# Altium schematic sheet FTDIProgrammer.SchDoc: FTDI Programming for MT3620
size A4; DrawnBy: Dheeraj R; DocumentNumber: 2; Revision: 2.0; SheetNumber: 2; SheetTotal: 5
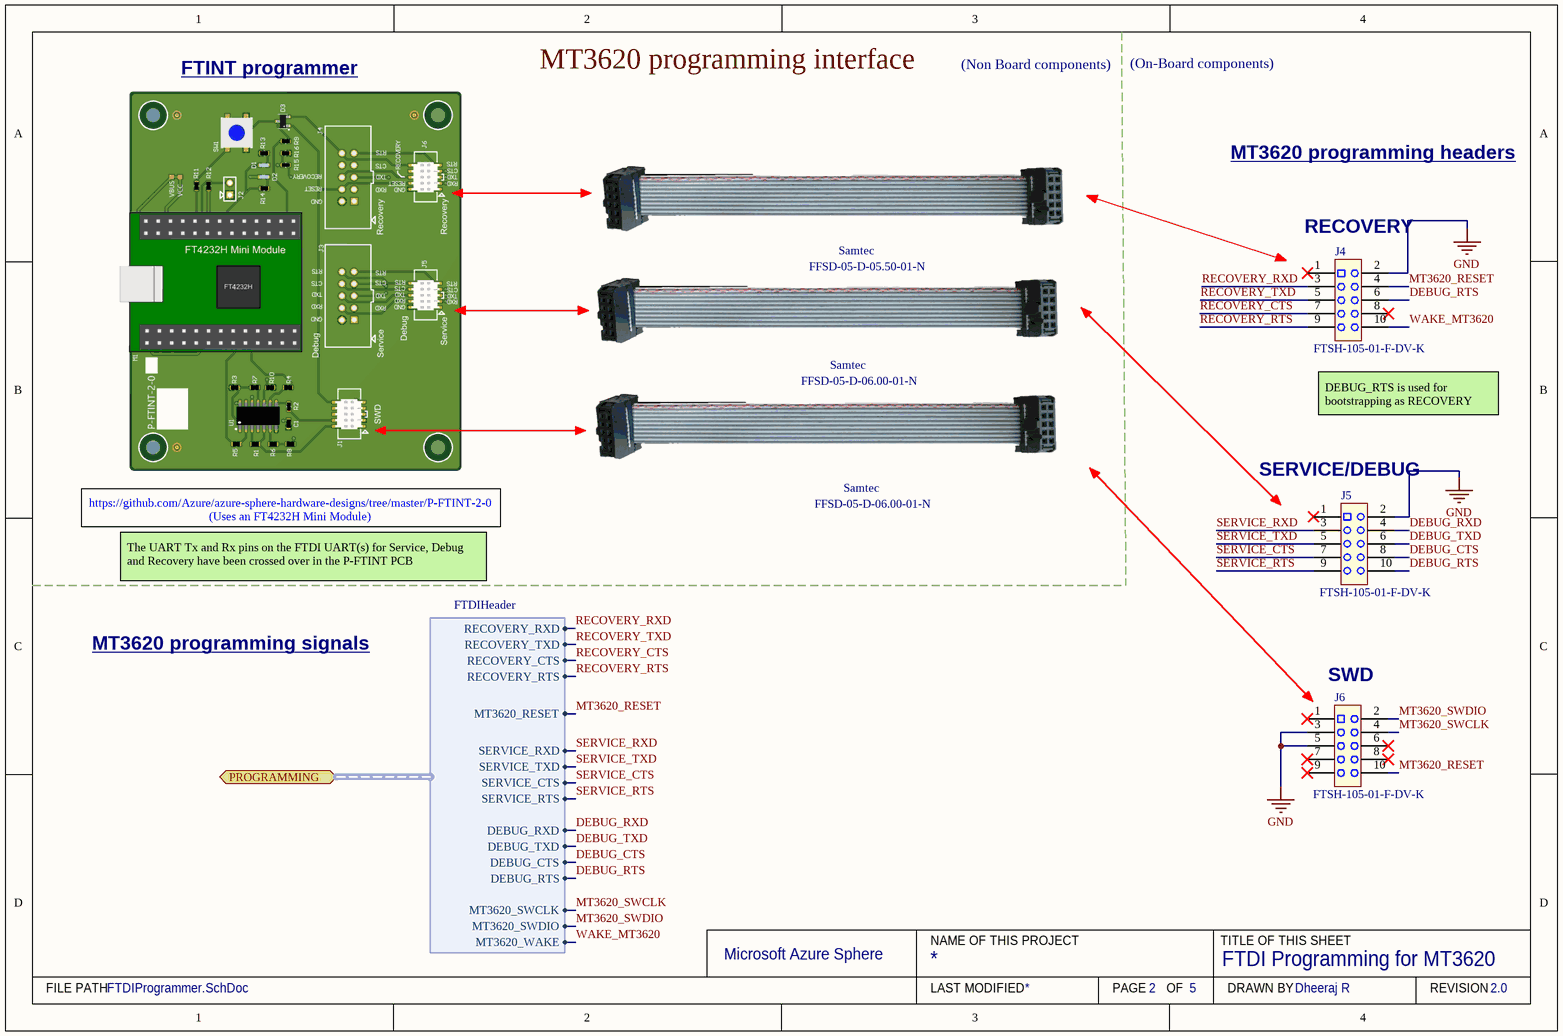
[diagram p0: FTDIProgrammer.SchDoc]

## Parts
J4  FTSH-105-01-F-DV-K  [SAMTEC-FTSH-105-01-X-DV-K]
J5  FTSH-105-01-F-DV-K  [SAMTEC-FTSH-105-01-X-DV-K]
J6  FTSH-105-01-F-DV-K  [SAMTEC-FTSH-105-01-X-DV-K]

## Ports
PROGRAMMING (bidir, harness FTDIHeader)

## Harnesses
FTDIHeader: RECOVERY_RXD, RECOVERY_TXD, RECOVERY_CTS, RECOVERY_RTS, MT3620_RESET, SERVICE_RXD, SERVICE_TXD, SERVICE_CTS, SERVICE_RTS, DEBUG_TXD, MT3620_SWCLK, MT3620_SWDIO, DEBUG_RXD, DEBUG_CTS, DEBUG_RTS, MT3620_WAKE

## Nets
GND: J4.2 J5.2 J6.3 J6.5
DEBUG_CTS: J5.8 ; port PROGRAMMING.DEBUG_CTS
DEBUG_RTS: J4.6 J5.10 ; port PROGRAMMING.DEBUG_RTS
DEBUG_RXD: J5.4 ; port PROGRAMMING.DEBUG_RXD
DEBUG_TXD: J5.6 ; port PROGRAMMING.DEBUG_TXD
MT3620_RESET: J4.4 J6.10 ; port PROGRAMMING.MT3620_RESET
MT3620_SWCLK: J6.4 ; port PROGRAMMING.MT3620_SWCLK
MT3620_SWDIO: J6.2 ; port PROGRAMMING.MT3620_SWDIO
RECOVERY_CTS: J4.7 ; port PROGRAMMING.RECOVERY_CTS
RECOVERY_RTS: J4.9 ; port PROGRAMMING.RECOVERY_RTS
RECOVERY_RXD: J4.3 ; port PROGRAMMING.RECOVERY_RXD
RECOVERY_TXD: J4.5 ; port PROGRAMMING.RECOVERY_TXD
SERVICE_CTS: J5.7 ; port PROGRAMMING.SERVICE_CTS
SERVICE_RTS: J5.9 ; port PROGRAMMING.SERVICE_RTS
SERVICE_RXD: J5.3 ; port PROGRAMMING.SERVICE_RXD
SERVICE_TXD: J5.5 ; port PROGRAMMING.SERVICE_TXD
WAKE_MT3620: J4.10 ; port PROGRAMMING.MT3620_WAKE

Not connected (* = marked no-connect by the designer): J4 1* 8*; J5 1*; J6 1* 6* 7* 8* 9*

## Notes on the sheet
- FTINT programmer
- MT3620 programming interface
- (Non Board components)
- (On-Board components)
- MT3620 programming headers
- Samtec
- (near J4) RECOVERY
- FFSD-05-D-05.50-01-N
- FFSD-05-D-06.00-01-N
- (near J4) DEBUG_RTS is used for
  bootstrapping as RECOVERY
- (near J5) SERVICE/DEBUG
- https://github.com/Azure/azure-sphere-hardware-designs/tree/master/P-FTINT-2-0
  (Uses an FT4232H Mini Module)
- The UART Tx and Rx pins on the FTDI UART(s) for Service, Debug and Recovery have been crossed over in the P-FTINT PCB
- MT3620 programming signals
- (near J6) SWD
- Microsoft Azure Sphere
- NAME OF THIS PROJECT
- TITLE OF THIS SHEET
- FILE PATH
- LAST MODIFIED
- PAGE
- OF
- DRAWN BY
- REVISION

## Library data of the parts
J4-J6 = FTSH-105-01-F-DV-K: CONN HEADER 10POS DUAL .05" SMD; Manufacturer: Samtec Inc.; Connector Type: Header, Unshrouded; Number of Positions: 10; Number of Positions Loaded: All; Pitch: 0.050" (1.27mm); Supplier 1: Digi-Key; Manufacturer Part Number: FTSH-105-01-F-DV-K; RoHS: RoHS Compliant; Category: Connectors, Interconnects; Stock 1: 13304; Pricing 1: 1=2.26, 10=1.907, 50=1.647, 100=1.4737, 250=1.30032, 500=1.21362, 1000=1.12693, 2500=1.08358, 5000=1.06191 (GBP); Packaging: Tube; Contact Type: Male Pin; Number of Rows: 2; Row Spacing: 0.050" (1.27mm); Contact Mating Length: 0.120" (3.05mm); Mounting Type: Surface Mount; Termination: Solder; Fastening Type: -; Features: Keying Shroud; Contact Finish: Gold; Contact Finish Thickness: 3µin (0.08µm); Color: Black; ComponentLink1URL: http://suddendocs.samtec.com/prints/ftsh-1xx-xx-xxx-dv-xxx-mkt.pdf; ComponentLink1Description: http://suddendocs.samtec.com/prints/ftsh-1xx-xx-xxx-dv-xxx-mkt.pdf; Supplier Part Number 1: SAM8796-ND